# EAGLE design CodeCard_002 (EAGLE 7.5.0)
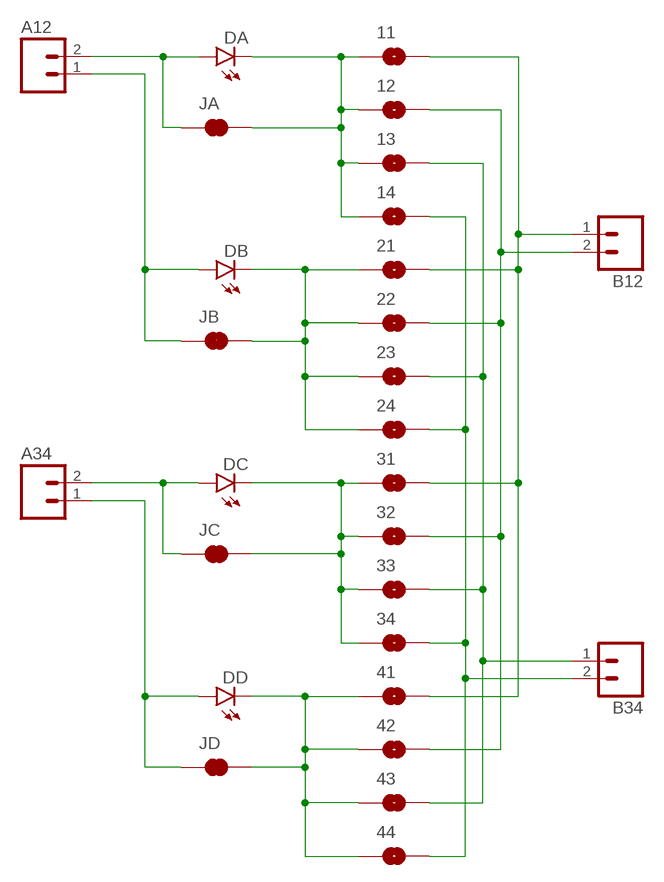
[diagram p0: schematic, sheet 1]

## Parts
11  JUMPER-PAD-2-NOROUND  [PAD-JUMPER-2-NO_YES_SILK_ROUND]
12  JUMPER-PAD-2-NOROUND  [PAD-JUMPER-2-NO_YES_SILK_ROUND]
13  JUMPER-PAD-2-NOROUND  [PAD-JUMPER-2-NO_YES_SILK_ROUND]
14  JUMPER-PAD-2-NOROUND  [PAD-JUMPER-2-NO_YES_SILK_ROUND]
21  JUMPER-PAD-2-NOROUND  [PAD-JUMPER-2-NO_YES_SILK_ROUND]
22  JUMPER-PAD-2-NOROUND  [PAD-JUMPER-2-NO_YES_SILK_ROUND]
23  JUMPER-PAD-2-NOROUND  [PAD-JUMPER-2-NO_YES_SILK_ROUND]
24  JUMPER-PAD-2-NOROUND  [PAD-JUMPER-2-NO_YES_SILK_ROUND]
31  JUMPER-PAD-2-NOROUND  [PAD-JUMPER-2-NO_YES_SILK_ROUND]
32  JUMPER-PAD-2-NOROUND  [PAD-JUMPER-2-NO_YES_SILK_ROUND]
33  JUMPER-PAD-2-NOROUND  [PAD-JUMPER-2-NO_YES_SILK_ROUND]
34  JUMPER-PAD-2-NOROUND  [PAD-JUMPER-2-NO_YES_SILK_ROUND]
41  JUMPER-PAD-2-NOROUND  [PAD-JUMPER-2-NO_YES_SILK_ROUND]
42  JUMPER-PAD-2-NOROUND  [PAD-JUMPER-2-NO_YES_SILK_ROUND]
43  JUMPER-PAD-2-NOROUND  [PAD-JUMPER-2-NO_YES_SILK_ROUND]
44  JUMPER-PAD-2-NOROUND  [PAD-JUMPER-2-NO_YES_SILK_ROUND]
A12  M02PTH3  [1X02_LONGPADS]
A34  M02PTH3  [1X02_LONGPADS]
B12  M02PTH3  [1X02_LONGPADS]
B34  M02PTH3  [1X02_LONGPADS]
DA  LED1206  [LED-1206]
DB  LED1206  [LED-1206]
DC  LED1206  [LED-1206]
DD  LED1206  [LED-1206]
JA  JUMPER-PAD-2-NC_BY_TRACENO_SILK  [PAD-JUMPER-2-NC_BY_TRACE_NO_SILK]
JB  JUMPER-PAD-2-NC_BY_TRACENO_SILK  [PAD-JUMPER-2-NC_BY_TRACE_NO_SILK]
JC  JUMPER-PAD-2-NC_BY_TRACENO_SILK  [PAD-JUMPER-2-NC_BY_TRACE_NO_SILK]
JD  JUMPER-PAD-2-NC_BY_TRACENO_SILK  [PAD-JUMPER-2-NC_BY_TRACE_NO_SILK]

## Nets
D: 41.1 42.1 43.1 44.1 DD.C JD.2
N$1: 11.1 12.1 13.1 14.1 DA.C JA.2
N$2: 21.1 22.1 23.1 24.1 DB.C JB.2
N$3: 31.1 32.1 33.1 34.1 DC.C JC.2
N$5: 11.2 21.2 31.2 41.2 B12.1
N$6: 12.2 22.2 32.2 42.2 B12.2
N$7: 13.2 23.2 33.2 43.2 B34.1
N$8: 14.2 24.2 34.2 44.2 B34.2
N$9: A12.1 DB.A JB.1
N$10: A12.2 DA.A JA.1
N$11: A34.1 DD.A JD.1
N$12: A34.2 DC.A JC.1

## Library data of the parts
11-14 21-24 31-34 41-44 = SparkFun-Passives:JUMPER-PAD-2-NO
A12 A34 B12 B34 = SparkFun-Connectors:M02: Standard 2-pin 0.1" header. Use with - straight break away headers ( PRT-00116) - right angle break away headers (PRT-00553) - swiss pins (PRT-00743) - machine pins (PRT-00117) - female headers (PRT-00115) Molex polarized connector foot print use with: PRT-08233 with associated crimp pins and housings. 2.54_SCREWTERM for use with PRT-10571. 3.5mm Screw Terminal footprints for PRT-08084 5mm Screw Terminal footprints for use with PRT-08432
DA DB DC DD = SparkFun-LED:LED: LEDs Standard schematic elements and footprints for 5mm, 3mm, 1206, and 0603 sized LEDs. 5mm - Spark Fun Electronics SKU : COM-00529 (and others)
JA JB JC JD = SparkFun-Passives:JUMPER-PAD-2-NC_BY_TRACE

## Board
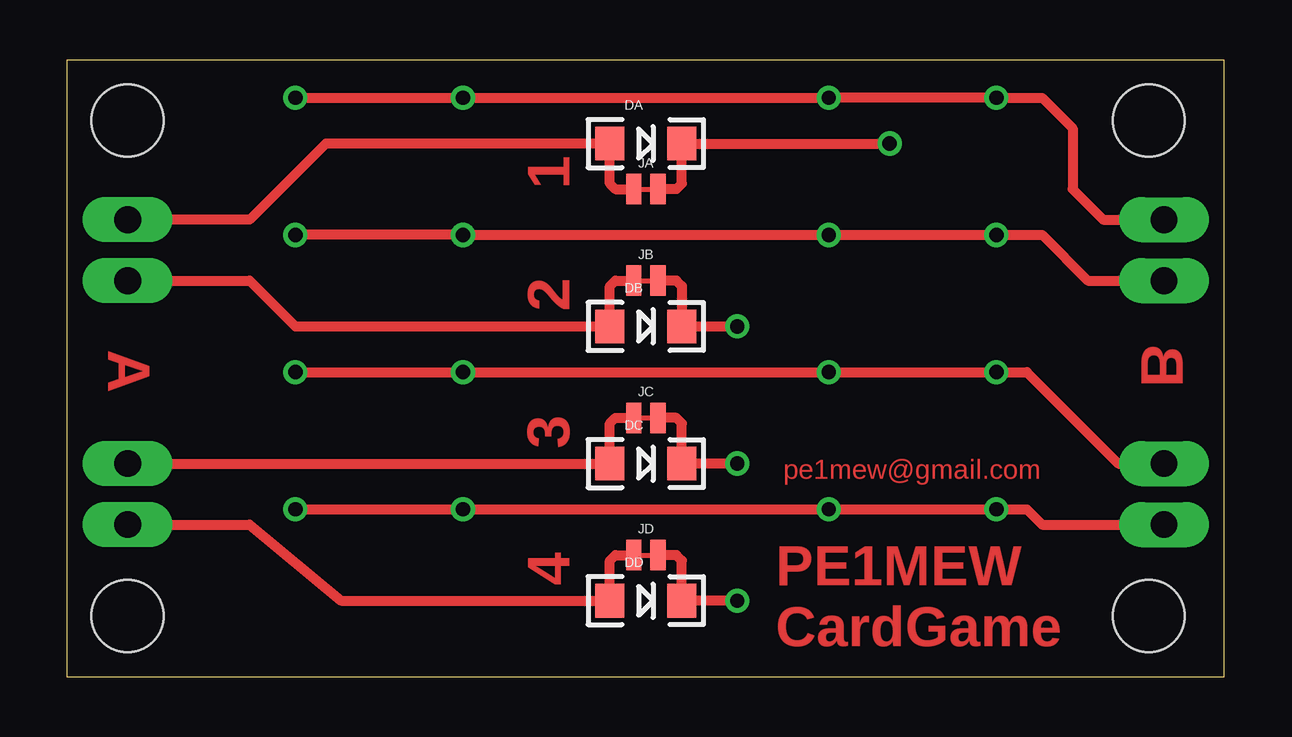
[diagram p1: board, top side]
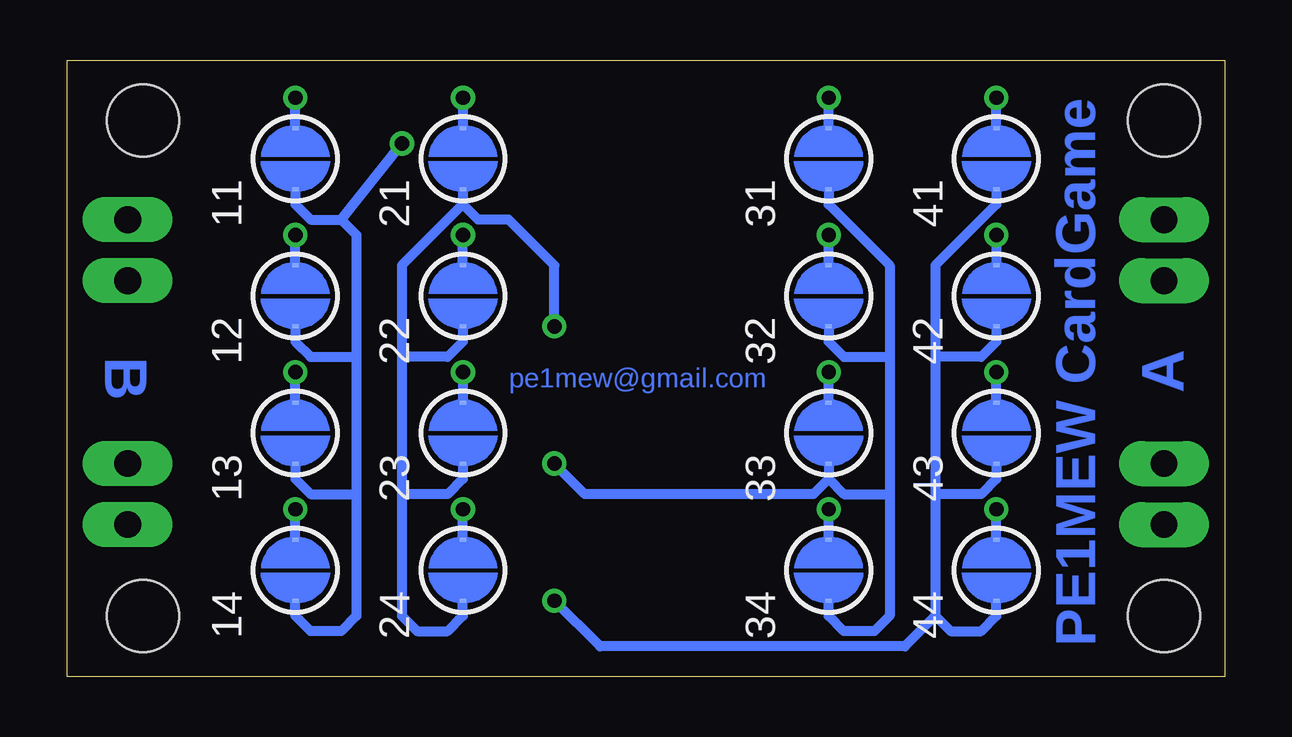
[diagram p2: board, bottom side, seen from below]

Size 48.24 x 25.7 mm. Coordinates in mm from the lower left corner, seen from the top.
Outline: 0,0 48.24,0 48.24,25.7 0,25.7 0,0
Copper layers (1*16): Top 0.035mm / dielectric 1.5mm / Bottom 0.035mm
Design rules "default": minimum track width 10mil, minimum drill 24mil, track to track 8mil, track to pad 8mil, pad to pad 8mil, via to via 8mil, smd to smd 8mil, copper to edge 40mil, drill to drill 8mil, minimum pad ring 10mil, minimum via ring 8mil, stop-mask expansion 4mil, vias tented up to drill 0mil, thermal gap 10mil
Holes 3 mm at 2.54,2.54 2.54,23.18 45.09,23.18 45.09,2.54

### Footprints (pad centres in the part's own frame; a part is rotated, then mirrored left to right if it is on the bottom)
PAD-JUMPER-2-NO_YES_SILK_ROUND = smd 0.152 x 0.305: 1 -1.27,0; 2 1.27,0
1X02_LONGPADS = drill 1.118 pad 1.88 long: 1 0,0; 2 2.54,0
LED-1206 = smd 1.2 x 1.4: A -1.5,0; C 1.5,0
PAD-JUMPER-2-NC_BY_TRACE_NO_SILK = smd 0.635 x 1.27: 1 -0.508,0; 2 0.508,0

### Placement (x,y rotation side)
11  38.73,21.59 90 bottom
12  38.73,15.88 90 bottom
13  38.73,10.16 90 bottom
14  38.73,4.45 90 bottom
21  31.75,21.59 90 bottom
22  31.75,15.88 90 bottom
23  31.75,10.16 90 bottom
24  31.75,4.45 90 bottom
31  16.51,21.59 90 bottom
32  16.51,15.88 90 bottom
33  16.51,10.16 90 bottom
34  16.51,4.45 90 bottom
41  9.53,21.59 90 bottom
42  9.53,15.88 90 bottom
43  9.53,10.16 90 bottom
44  9.53,4.45 90 bottom
A12  2.54,16.51 90 top
A34  2.54,6.35 90 top
B12  45.72,19.05 270 top
B34  45.72,8.89 270 top
DA  24.13,22.23 0 top
DB  24.13,14.61 0 top
DC  24.13,8.89 0 top
DD  24.13,3.17 0 top
JA  24.13,20.32 0 top
JB  24.13,16.51 0 top
JC  24.13,10.79 0 top
JD  24.13,5.08 0 top

### Tracks (layer width: path | path; a pad name or v marks a point on that pad's centre or on a via)
D  (via drill 0.6)
  Top 0.406: JD.2 25.4,5.08 25.63,4.85 DD.C v27.94,3.17
  Bottom 0.406: 41.1 9.53,19.68 12.06,17.14 12.06,13.34 | 12.06,13.34 12.06,7.62 | 12.06,2.54 11.43,1.91 10.16,1.91 9.53,2.54 44.1 | 42.1 9.53,13.97 10.16,13.34 12.06,13.34 | 43.1 9.53,8.26 10.16,7.62 12.06,7.62 | 12.06,7.62 12.06,2.54 | 12.06,2.54 13.34,1.27 26.04,1.27 v27.94,3.17
N$1  (via drill 0.6)
  Top 0.406: DA.C 25.63,22 | JA.2 25.4,20.32 25.63,20.55 25.63,22 | 25.63,22 25.4,22.23 v34.29,22.23
  Bottom 0.406: 11.1 38.73,19.68 38.1,19.05 36.83,19.05 | 36.2,13.34 36.2,18.41 36.83,19.05 | 36.2,13.34 36.2,7.62 | 36.2,7.62 36.2,2.54 36.83,1.91 38.1,1.91 38.73,2.54 14.1 | 13.1 38.73,8.26 38.1,7.62 36.2,7.62 | 12.1 38.73,13.97 38.1,13.34 36.2,13.34 | 36.83,19.05 v34.29,22.23
N$2  (via drill 0.6)
  Top 0.406: DB.C 25.63,15.01 | JB.2 25.4,16.51 25.63,16.28 25.63,15.01 | 25.63,15.01 26.04,14.61 v27.94,14.61
  Bottom 0.406: 21.1 31.75,19.68 | 31.75,19.68 34.29,17.14 34.29,13.34 | 34.29,13.34 34.29,7.62 | 34.29,7.62 34.29,2.54 33.66,1.91 32.38,1.91 31.75,2.54 24.1 | 22.1 31.75,13.97 32.38,13.34 34.29,13.34 | 23.1 31.75,8.26 32.38,7.62 34.29,7.62 | 31.75,19.68 31.11,19.05 29.84,19.05 27.94,17.14 v27.94,14.61
N$3  (via drill 0.6)
  Top 0.406: JC.2 25.4,10.79 25.63,10.56 DC.C v27.94,8.89
  Bottom 0.406: 31.1 16.51,19.68 13.97,17.14 13.97,13.34 | 34.1 16.51,2.54 15.88,1.91 14.61,1.91 13.97,2.54 13.97,7.62 | 32.1 16.51,13.97 15.88,13.34 13.97,13.34 | 13.97,13.34 13.97,7.62 | 16.51,8.26 15.88,7.62 13.97,7.62 | 33.1 16.51,8.26 | 16.51,8.26 17.14,7.62 26.67,7.62 v27.94,8.89
N$5  (via drill 0.6)
  Top 0.406: v9.53,24.13 v16.51,24.13 v31.75,24.13 v38.73,24.13 40.64,24.13 41.91,22.86 41.91,20.32 43.18,19.05 B12.1
  Bottom 0.406: 41.2 v9.53,24.13 | 31.2 v16.51,24.13 | v31.75,24.13 21.2 | 11.2 v38.73,24.13
N$6  (via drill 0.6)
  Top 0.406: v9.53,18.41 v16.51,18.41 v31.75,18.41 v38.73,18.41 40.64,18.41 42.55,16.51 B12.2
  Bottom 0.406: v9.53,18.41 42.2 | 32.2 v16.51,18.41 | 22.2 v31.75,18.41 | 12.2 v38.73,18.41
N$7  (via drill 0.6)
  Top 0.406: v9.53,12.7 v16.51,12.7 v31.75,12.7 v38.73,12.7 40.01,12.7 43.81,8.89 B34.1
  Bottom 0.406: 43.2 v9.53,12.7 | 33.2 v16.51,12.7 | v31.75,12.7 23.2 | 13.2 v38.73,12.7
N$8  (via drill 0.6)
  Top 0.406: v9.53,6.99 v16.51,6.99 v31.75,6.99 v38.73,6.99 40.01,6.99 40.64,6.35 B34.2
  Bottom 0.406: 44.2 v9.53,6.99 | 34.2 v16.51,6.99 | 24.2 v31.75,6.99 | 14.2 v38.73,6.99
N$9
  Top 0.406: JB.1 22.86,16.51 22.63,16.28 DB.A 9.53,14.61 7.62,16.51 A12.1
N$10
  Top 0.406: DA.A 22.63,21.82 | JA.1 22.86,20.32 22.63,20.55 22.63,21.82 | 22.63,21.82 22.23,22.23 10.79,22.23 7.62,19.05 A12.2
N$11
  Top 0.406: JD.1 22.86,5.08 22.63,4.85 DD.A 11.43,3.17 7.62,6.35 A34.1
N$12
  Top 0.406: JC.1 22.86,10.79 22.63,10.56 DC.A A34.2

### Text on the board
Top: 1 | 2 | A | B | 3 | pe1mew@gmail.com | 4 | PE1MEW | CardGame
Bottom: A | B | pe1mew@gmail.com | PE1MEW CardGame